# EAGLE design l3 (EAGLE 9.7.0)

## Sheet 1 of 3
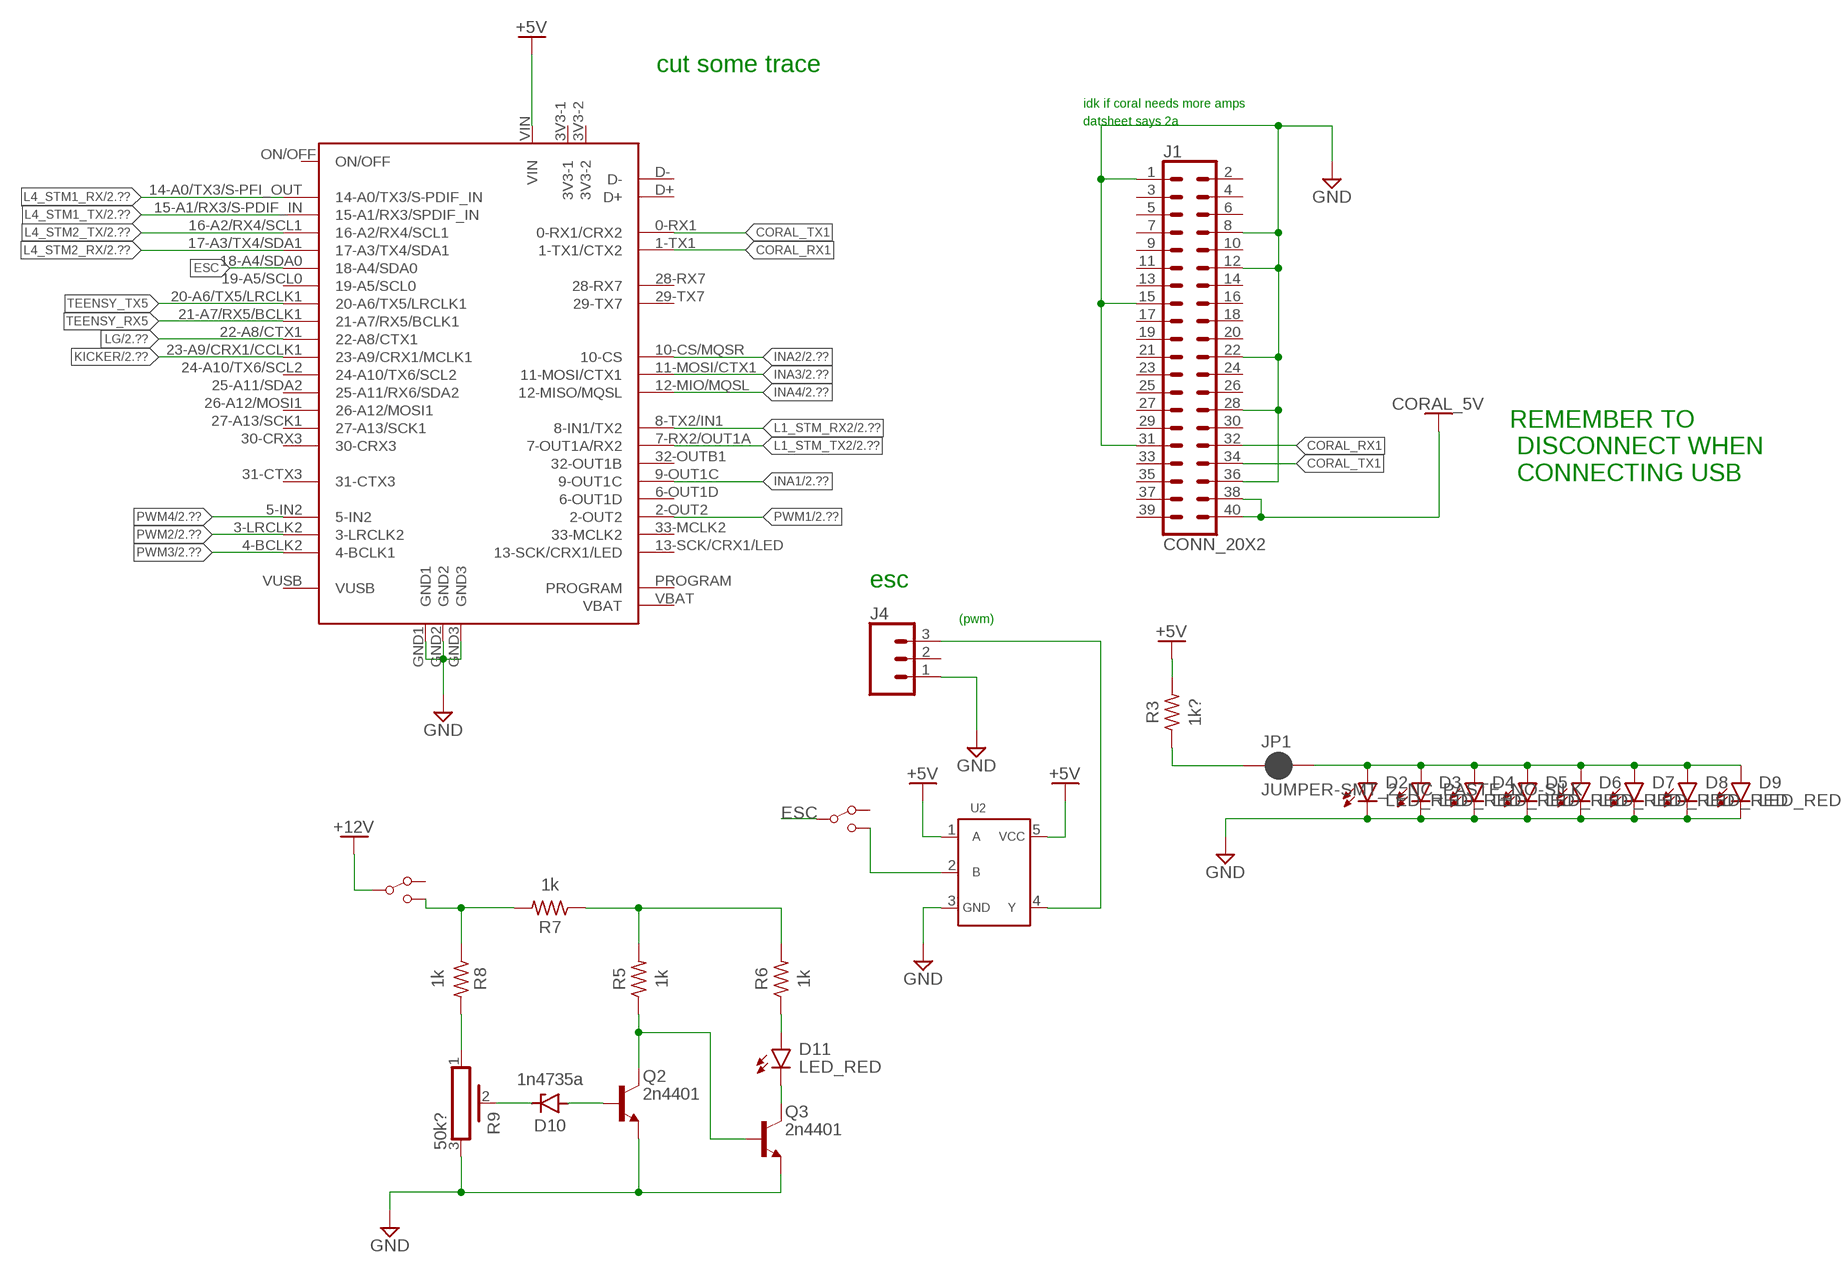
[diagram p0: schematic, sheet 1]

### Parts
D2  LED_RED  CHIP-FLAT-R_0603-0.55MM  [LEDC1608X55N_FLAT-R]
D3  LED_RED  CHIP-FLAT-R_0603-0.55MM  [LEDC1608X55N_FLAT-R]
D4  LED_RED  CHIP-FLAT-R_0603-0.55MM  [LEDC1608X55N_FLAT-R]
D5  LED_RED  CHIP-FLAT-R_0603-0.55MM  [LEDC1608X55N_FLAT-R]
D6  LED_RED  CHIP-FLAT-R_0603-0.55MM  [LEDC1608X55N_FLAT-R]
D7  LED_RED  CHIP-FLAT-R_0603-0.55MM  [LEDC1608X55N_FLAT-R]
D8  LED_RED  CHIP-FLAT-R_0603-0.55MM  [LEDC1608X55N_FLAT-R]
D9  LED_RED  CHIP-FLAT-R_0603-0.55MM  [LEDC1608X55N_FLAT-R]
D10  1n4735a  ZENER  [DO41]
D11  LED_RED  CHIP-FLAT-R_0603-0.55MM  [LEDC1608X55N_FLAT-R]
J1  CONN_20X2  [2X20]
J4  CONN_03LOCK  [1X03_LOCK]
JP1  JUMPER-SMT_2_NC_PASTE_NO-SILK  [SMT-JUMPER_2_NC_PASTE_NO-SILK]
Q2  2n4401  NPN_TO92-EBC  [TO92]
Q3  2n4401  NPN_TO92-EBC  [TO92]
R3  1k?  R-US_CHIP-0603(1608-METRIC)  [RESC1608X60]
R5  1k  R-US_CHIP-0603(1608-METRIC)  [RESC1608X60]
R6  1k  R-US_CHIP-0603(1608-METRIC)  [RESC1608X60]
R7  1k  R-US_CHIP-0603(1608-METRIC)  [RESC1608X60]
R8  1k  R-US_CHIP-0603(1608-METRIC)  [RESC1608X60]
R9  50k?  PV36X  [PV36X]
S1  SPDT-SLIDE-SWITCHSWITCH-TH  [SWITCH-TH]
S2  SPDT-SLIDE-SWITCHSWITCH-TH  [SWITCH-TH]
U2  SN74AHCT1G08  [SOT23-5]
U$1  TEENSY40  [TEENSY40]

### Nets
+5V: R3.2 U2.1 U2.5 U$1.VIN ; also sheet 3
+12V: S1.P$2 ; also sheet 2,3
CORAL_5V: J1.38 J1.40 ; also sheet 3
CORAL_RX1: J1.32 U$1.1-TX1(1-TX1/CTX2)
CORAL_TX1: J1.34 U$1.0-RX1(0-RX1/CRX2)
ESC: S2.P$2 U$1.18-A4/SDA0
GND: D2.C D3.C D4.C D5.C D6.C D7.C D8.C D9.C J1.1 J1.8 J1.12 J1.15 J1.22 J1.28 J1.31 J1.36 J4.1 Q2.1(E) Q3.1(E) R9.3 U2.3 U$1.GND1 U$1.GND2 U$1.GND3 ; also sheet 2,3
INA1: U$1.9-OUT1C ; also sheet 2
INA2: U$1.10-CS/MQSR(10-CS) ; also sheet 2
INA3: U$1.11-MOSI/CTX1 ; also sheet 2
INA4: U$1.12-MIO/MQSL(12-MISO/MQSL) ; also sheet 2
KICKER: U$1.23-A9/CRX1/CCLK1(23-A9/CRX1/MCLK1) ; also sheet 2
L1_STM_RX2: U$1.8-TX2/IN1(8-IN1/TX2) ; also sheet 2
L1_STM_TX2: U$1.7-RX2/OUT1A(7-OUT1A/RX2) ; also sheet 2
L4_STM1_RX: U$1.14-A0/TX3/S-PFI_OUT(14-A0/TX3/S-PDIF_IN) ; also sheet 2
L4_STM1_TX: U$1.15-A1/RX3/S-PDIF_IN(15-A1/RX3/SPDIF_IN) ; also sheet 2
L4_STM2_RX: U$1.17-A3/TX4/SDA1 ; also sheet 2
L4_STM2_TX: U$1.16-A2/RX4/SCL1 ; also sheet 2
LG: U$1.22-A8/CTX1 ; also sheet 2
N$1: D2.A D3.A D4.A D5.A D6.A D7.A D8.A D9.A JP1.2
N$21: JP1.1 R3.1
N$22: D10.C R9.2
N$23: D10.A Q2.2(B)
N$24: Q2.3(C) Q3.2(B) R5.1
N$25: R8.2 R9.1
N$26: R5.2 R6.2 R7.1
N$27: D11.A R6.1
N$28: D11.C Q3.3(C)
N$29: R7.2 R8.1 S1.P$3
N$30: S2.P$3 U2.2
N$32: J4.3 U2.4
PWM1: U$1.2-OUT2 ; also sheet 2
PWM2: U$1.3-LRCLK2 ; also sheet 2
PWM3: U$1.4-BCLK2(4-BCLK1) ; also sheet 2
PWM4: U$1.5-IN2 ; also sheet 2
TEENSY_RX5: U$1.21-A7/RX5/BCLK1
TEENSY_TX5: U$1.20-A6/TX5/LRCLK1
Unconnected: J1.2 J1.3 J1.4 J1.5 J1.6 J1.7 J1.9 J1.10 J1.11 J1.13 J1.14 J1.16 J1.17 J1.18 J1.19 J1.20 J1.21 J1.23 J1.24 J1.25 J1.26 J1.27 J1.29 J1.30 J1.33 J1.35 J1.37 J1.39 J4.2 S1.P$1 S2.P$1 U$1.3V3-1 U$1.3V3-2 U$1.6-OUT1D U$1.13-SCK/CRX1/LED U$1.19-A5/SCL0 U$1.24-A10/TX6/SCL2 U$1.25-A11/SDA2(25-A11/RX6/SDA2) U$1.26-A12/MOSI1 U$1.27-A13/SCK1 U$1.28-RX7 U$1.29-TX7 U$1.30-CRX3 U$1.31-CTX3 U$1.32-OUTB1(32-OUT1B) U$1.33-MCLK2 U$1.D+ U$1.D- U$1.ON/OFF U$1.PROGRAM U$1.VBAT U$1.VUSB

### Notes on the sheet
- cut some trace
- idk if coral needs more amps
- datsheet says 2a
- REMEMBER TO
   DISCONNECT WHEN
   CONNECTING USB
- esc
- (pwm)

## Sheet 2 of 3
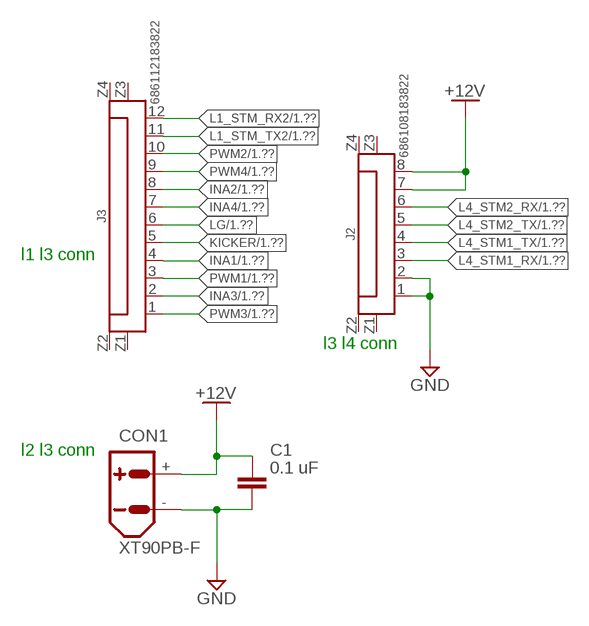
[diagram p1: schematic, sheet 2]

### Parts
C1  0.1 uF  C_CHIP-0603(1608-METRIC)  [CAPC1608X85]
CON1  XT90PB-F  [XT90PB-F]
J2  686108183822  6861XX183822_686108183822  [686108183822]
J3  686112183822  6861XX183822_686112183822  [686112183822]

### Nets
+12V: C1.1 CON1.+ J2.7 J2.8 ; also sheet 1,3
GND: C1.2 CON1.- J2.1 J2.2 ; also sheet 1,3
INA1: J3.4 ; also sheet 1
INA2: J3.8 ; also sheet 1
INA3: J3.2 ; also sheet 1
INA4: J3.7 ; also sheet 1
KICKER: J3.5 ; also sheet 1
L1_STM_RX2: J3.12 ; also sheet 1
L1_STM_TX2: J3.11 ; also sheet 1
L4_STM1_RX: J2.3 ; also sheet 1
L4_STM1_TX: J2.4 ; also sheet 1
L4_STM2_RX: J2.6 ; also sheet 1
L4_STM2_TX: J2.5 ; also sheet 1
LG: J3.6 ; also sheet 1
PWM1: J3.3 ; also sheet 1
PWM2: J3.10 ; also sheet 1
PWM3: J3.1 ; also sheet 1
PWM4: J3.9 ; also sheet 1
Unconnected: J2.Z1 J2.Z2 J2.Z3 J2.Z4 J3.Z1 J3.Z2 J3.Z3 J3.Z4

### Notes on the sheet
- l1 l3 conn
- l3 l4 conn
- l2 l3 conn

## Sheet 3 of 3
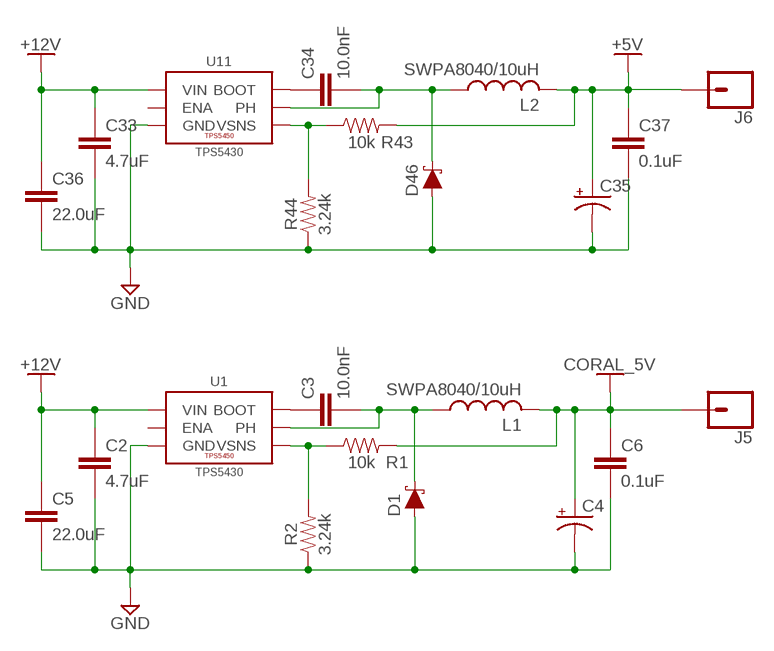
[diagram p2: schematic, sheet 3]

### Parts
C2  4.7uF  CAPACITOR0603  [C0603]
C3  10.0nF  CAPACITOR0603  [C0603]
C4  220uF  CPOL-USD/7343-31R  [D/7343-31R]
C5  22.0uF  CAPACITOR1210  [C1210]
C6  0.1uF  CAPACITOR0603  [C0603]
C33  4.7uF  CAPACITOR0603  [C0603]
C34  10.0nF  CAPACITOR0603  [C0603]
C35  220uF  CPOL-USD/7343-31R  [D/7343-31R]
C36  22.0uF  CAPACITOR1210  [C1210]
C37  0.1uF  CAPACITOR0603  [C0603]
D1  3A/40V/500mV  DIODE-SCHOTTKY-B340A  [SMA-DIODE]
D46  3A/40V/500mV  DIODE-SCHOTTKY-B340A  [SMA-DIODE]
J5  CONN_01  [1X01]
J6  CONN_01  [1X01]
L1  SWPA8040/10uH  INDUCTORSWPA8040  [SWPA8040]
L2  SWPA8040/10uH  INDUCTORSWPA8040  [SWPA8040]
R1  10k  RESISTOR0603  [R0603]
R2  3.24k  RESISTOR0603  [R0603]
R43  10k  RESISTOR0603  [R0603]
R44  3.24k  RESISTOR0603  [R0603]
U1  TPS5430  TPS5450  [POWERPAD-SOIC-8]
U11  TPS5430  TPS5450  [POWERPAD-SOIC-8]

### Nets
+5V: C35.+ C37.1 J6.1 L2.P2 R43.2 ; also sheet 1
+12V: C2.1 C5.1 C33.1 C36.1 U1.7(VIN) U11.7(VIN) ; also sheet 1,2
CORAL_5V: C4.+ C6.1 J5.1 L1.P2 R1.2 ; also sheet 1
GND: C2.2 C4.- C5.2 C6.2 C33.2 C35.- C36.2 C37.2 D1.A D46.A R2.1 R44.1 U1.6(GND) U1.9(GND) U1.P$1(GND) U1.P$2(GND) U1.P$3(GND) U1.P$4(GND) U1.P$5(GND) U1.P$6(GND) U11.6(GND) U11.9(GND) U11.P$1(GND) U11.P$2(GND) U11.P$3(GND) U11.P$4(GND) U11.P$5(GND) U11.P$6(GND) ; also sheet 1,2
N$5: C3.2 D1.C L1.P1 U1.8(PH)
N$6: R1.1 R2.2 U1.4(VSNS)
N$7: C3.1 U1.1(BOOT)
N$45: C34.2 D46.C L2.P1 U11.8(PH)
N$96: R43.1 R44.2 U11.4(VSNS)
N$97: C34.1 U11.1(BOOT)
Unconnected: U1.2(NC) U1.3(NC) U1.5(ENA) U11.2(NC) U11.3(NC) U11.5(ENA)

## Library data of the parts
C1 = Capacitor:C: Capacitor - Generic; CATEGORY: Capacitor
C2 C3 C5 C6 C33 C34 C36 C37 = JH:CAPACITOR
C4 C35 = rcl:CPOL-US: POLARIZED CAPACITOR, American symbol; SPICEPREFIX: C
CON1 = amass xt series:XT90: AMASS XT90 connector Store in Japan AMASS XT90 connector <https://szc.jp/ams-xt90>
D1 D46 = SparkFun-DiscreteSemi:DIODE-SCHOTTKY: Schottky diode A Schottky diode is a semiconductor diode which has a low forward voltage drop and a very fast switching action.; PROD_ID: DIO-09886
D2-D9 D11 = LED:CHIP-FLAT-R; CATEGORY: LED; COLOR: RED; DESCRIPTION: CHIP LED FLAT; SUB-CATEGORY: CHIP; TYPE: FLAT_TOP
D10 = diodess:ZENER: Zener Diode - Generic
J1 = SparkFun-Connectors:CONN_20X2: Multi connection point. Often used as Generic Header-pin footprint for 0.1 inch spaced/style header connections On any of the 0.1 inch spaced packages, you can populate with these: Break Away Headers - Straight <https://www.sparkfun.com/products/116> (PRT-00116) Break Away Male Headers - Right Angle <https://www.sparkfun.com/products/553> (PRT-00553) Female Headers <https://www.sparkfun.com/products/115> (PRT-00115) Break Away Headers - Machine Pin <https://www.sparkfun.com/products/117> (PRT-00117) Break Away Female Headers - Swiss Machine Pin <https://www.sparkfun.com/products/743> (PRT-00743)
J2 = Wurth_Connectors_WR-FPC:6861XX183822_686108183822: WR-FPC 1.00 mm SMT ZIF Vertical Type A KIND PROPERTIES Pitch 1 mm MATERIAL PROPERTIES Insulator Material PA6T Contact Material Phosphor Bronze Contact Plating 120 (µ") Tin over 30 (µ") Nickel Solder Tabs Brass <https://www.we-online.com/catalog/media/o83988v209%20Family_WR-FPC_6861xx183822.jpg> Details see: https://www.we-online.com/catalog/en/FPC_1_00_SMT_ZIF_VERTICAL_TYPE_A_6861XX183822/ Updated by Ella Wu, 2020-08-25 2020 (C) Würth Elektronik; CONTACT-RESISTANCE: 30mOhm; DATASHEET-URL: https://www.we-online.com/catalog/datasheet/686108183822.pdf; IR: 1A; L: 14.8mm; MATE-WITH: WR-FFC 1.00 mm Flat Flexible Cable Type 1 (Contacts on same side)/ Type 2 (Contacts opposite); PACKAGING: Tape and Reel; PART-NUMBER: 686108183822; PINS: 8; PITCH: 1mm; TYPE: Vertical; WORKING-VOLTAGE: 125V(AC)
J3 = Wurth_Connectors_WR-FPC:6861XX183822_686112183822: WR-FPC 1.00 mm SMT ZIF Vertical Type A KIND PROPERTIES Pitch 1 mm MATERIAL PROPERTIES Insulator Material PA6T Contact Material Phosphor Bronze Contact Plating 120 (µ") Tin over 30 (µ") Nickel Solder Tabs Brass <https://www.we-online.com/catalog/media/o83988v209%20Family_WR-FPC_6861xx183822.jpg> Details see: https://www.we-online.com/catalog/en/FPC_1_00_SMT_ZIF_VERTICAL_TYPE_A_6861XX183822/ Updated by Ella Wu, 2020-08-25 2020 (C) Würth Elektronik; CONTACT-RESISTANCE: 30mOhm; DATASHEET-URL: https://www.we-online.com/catalog/datasheet/686112183822.pdf; IR: 1A; L: 18.8mm; MATE-WITH: WR-FFC 1.00 mm Flat Flexible Cable Type 1 (Contacts on same side)/ Type 2 (Contacts opposite); PACKAGING: Tape and Reel; PART-NUMBER: 686112183822; PINS: 12; PITCH: 1mm; TYPE: Vertical; WORKING-VOLTAGE: 125V(AC)
J4 = SparkFun-Connectors:CONN_03: Multi connection point. Often used as Generic Header-pin footprint for 0.1 inch spaced/style header connections On any of the 0.1 inch spaced packages, you can populate with these: Break Away Headers - Straight <https://www.sparkfun.com/products/116> (PRT-00116) Break Away Male Headers - Right Angle <https://www.sparkfun.com/products/553> (PRT-00553) Female Headers <https://www.sparkfun.com/products/115> (PRT-00115) Break Away Headers - Machine Pin <https://www.sparkfun.com/products/117> (PRT-00117) Break Away Female Headers - Swiss Machine Pin <https://www.sparkfun.com/products/743> (PRT-00743) Stackable Header - 3 Pin (Female, 0.1") <https://www.sparkfun.com/products/13875> (PRT-13875) For SCREWTERMINALS and SPRING TERMINALS visit here: Screw Terimnals on SparkFun.com <https://www.sparkfun.com/search/results?term=Screw+Terminals> (5mm/3.5mm/2.54mm spacing) This device is also useful as a general connection point to wire up your design to another part of your project. Our various solder wires solder well into these plated through hole pads. Hook-Up Wire - Assortment (Stranded, 22 AWG) <https://www.sparkfun.com/products/11375> (PRT-11375) Hook-Up Wire - Assortment (Solid Core, 22 AWG) <https://www.sparkfun.com/products/11367> (PRT-11367) View the entire wire category on our website here <https://www.sparkfun.com/categories/141> Special notes: Molex polarized connector foot print use with SKU : PRT-08232 with associated crimp pins and housings.
J5 J6 = SparkFun-Connectors:CONN_01: Single connection point. Often used as Generic Header-pin footprint for 0.1 inch spaced/style header connections On any of the 0.1 inch spaced packages, you can populate with these: Break Away Headers - Straight <https://www.sparkfun.com/products/116> (PRT-00116) Break Away Male Headers - Right Angle <https://www.sparkfun.com/products/553> (PRT-00553) Female Headers <https://www.sparkfun.com/products/115> (PRT-00115) Break Away Headers - Machine Pin <https://www.sparkfun.com/products/117> (PRT-00117) Break Away Female Headers - Swiss Machine Pin <https://www.sparkfun.com/products/743> (PRT-00743) This device is also useful as a general connection point to wire up your design to another part of your project. Our various solder wires solder well into these plated through hole pads. Hook-Up Wire - Assortment (Stranded, 22 AWG) <https://www.sparkfun.com/products/11375> (PRT-11375) Hook-Up Wire - Assortment (Solid Core, 22 AWG) <https://www.sparkfun.com/products/11367> (PRT-11367) View the entire wire category on our website here <https://www.sparkfun.com/categories/141> Special notes: SMTSO-256-ET is a "flush mount" nut for a 4-40 screw. We mostly use this on specialty testbeds; it is a nice way to connect hardware to your PCB at an adjustable hieght. Also note, the SNAP packages are for using a snappable style connector. We sell a baggie of snaps and they are also used on two LilyPad designs: Snap Assortment - 30 pack (male and female) <https://www.sparkfun.com/products/11347> (DEV-11347) LilyPad Arduino SimpleSnap <https://www.sparkfun.com/products/10941> (DEV-10941) LilyPad SimpleSnap Protoboard <https://www.sparkfun.com/products/10940> (DEV-10940)
JP1 = SparkFun-Jumpers:JUMPER-SMT_2_NC_PASTE: Normally closed solder jumper This jumper has an aperture in the stencil to allow solder paste to bridge the split in the wire so it's normally closed (NC). Wick off the solder to open the connection. Reapply solder to reclose the connection.
L1 L2 = JH:INDUCTOR
Q2 Q3 = Transistor:NPN: NPN - Generic; CATEGORY: Transistor; SUB-CATEGORY: BJT; TYPE: NPN; VALUE: NPN
R1 R2 R43 R44 = JH:RESISTOR
R3 R5-R8 = Resistor:R-US: Resistor Fixed - ANSI; CATEGORY: Resistor; SUB-CATEGORY: Fixed
R9 = Resistor:PV36: Rectangular Trimmer Potentiometers - PV36 Series Datasheet <https://www.bourns.com/docs/Product-Datasheets/pv36.pdf>; CATEGORY: Resistor; DESCRIPTION: Lead Sealed Type Multiturn PV36 Series; MANUFACTURER: BOURNS; MPN: PV36X; OPERATING_TEMPERATURE: -55 to +125 °C; PART_STATUS: Active; ROHS_COMPLIANCE: RoHS Compliant; SERIES: PV36; SUB-CATEGORY: Trimpot; TYPE: Lead sealed
S1 S2 = i want to make my own parts:SPDT-SLIDE-SWITCH
U1 U11 = JH:TPS5450
U2 = i want to make my own parts:SN74AHCT1G08
U$1 = teensy:TEENSY40: Teensy 4.0 device including POGO pins for pins 24 - 33, but not yet pins for D+ and D-. Symbol layout is what works for me and may not suite everyone... that can be added or additional symbols can be created to be used in a modilied davie name.

## Board
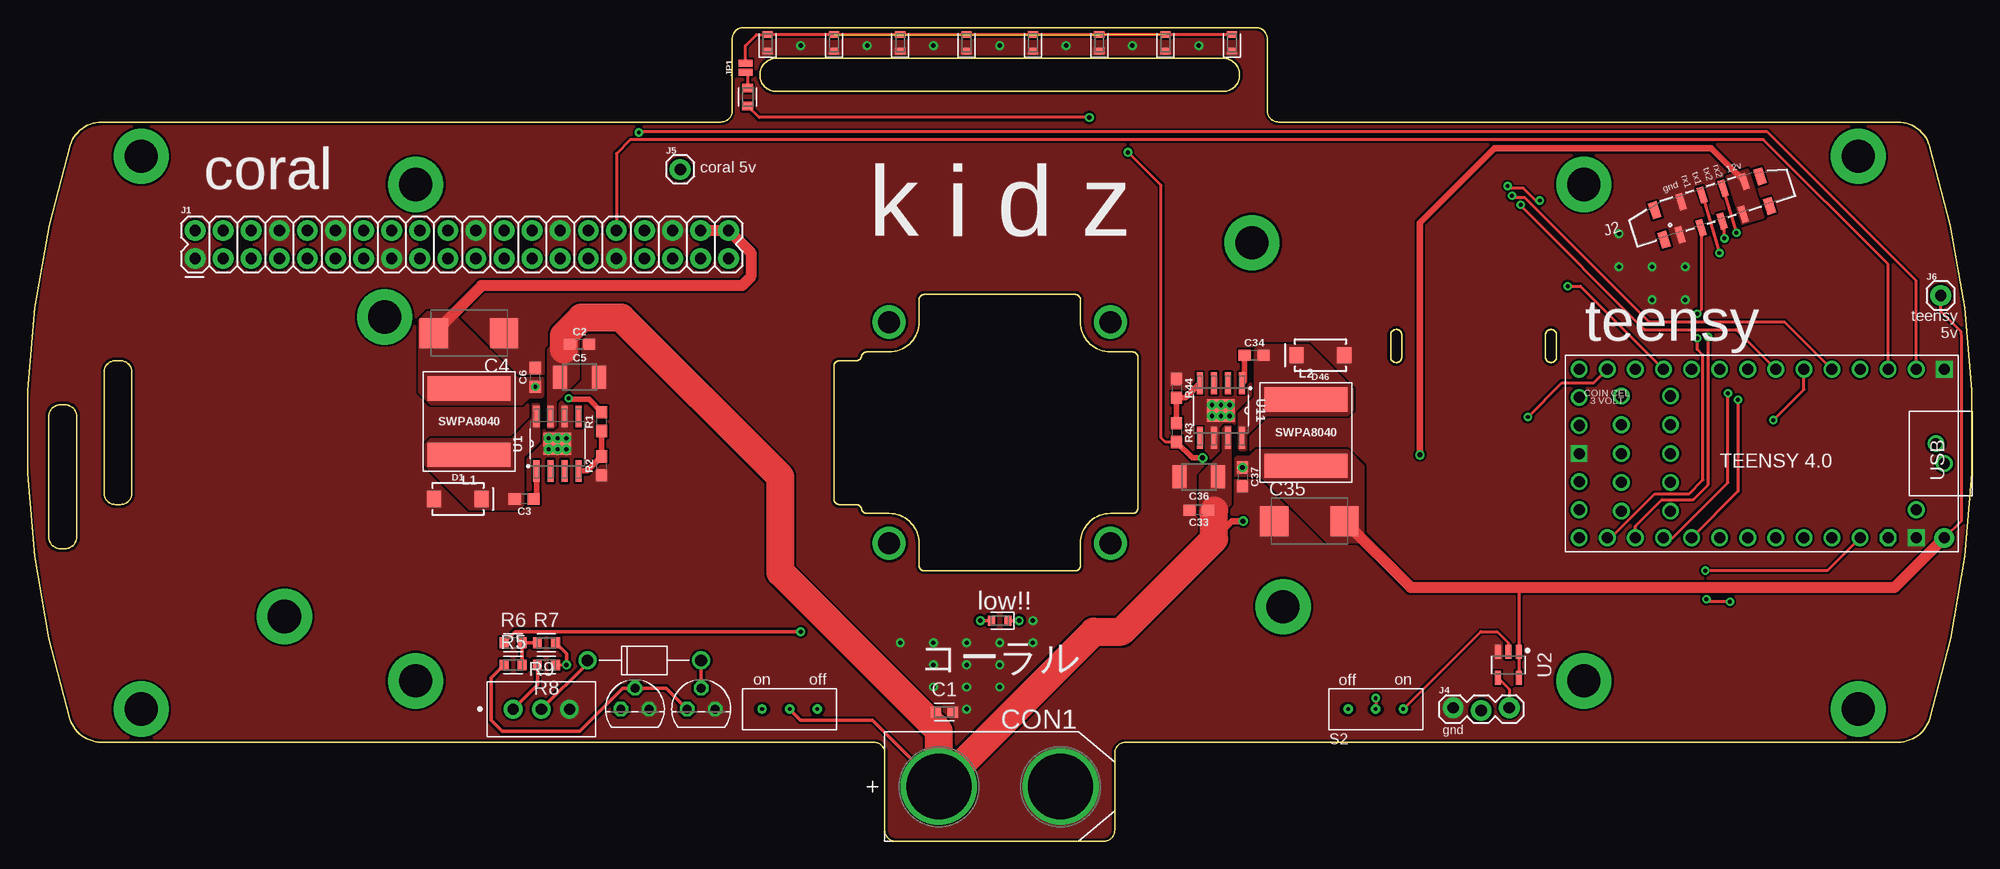
[diagram p3: board, top side]
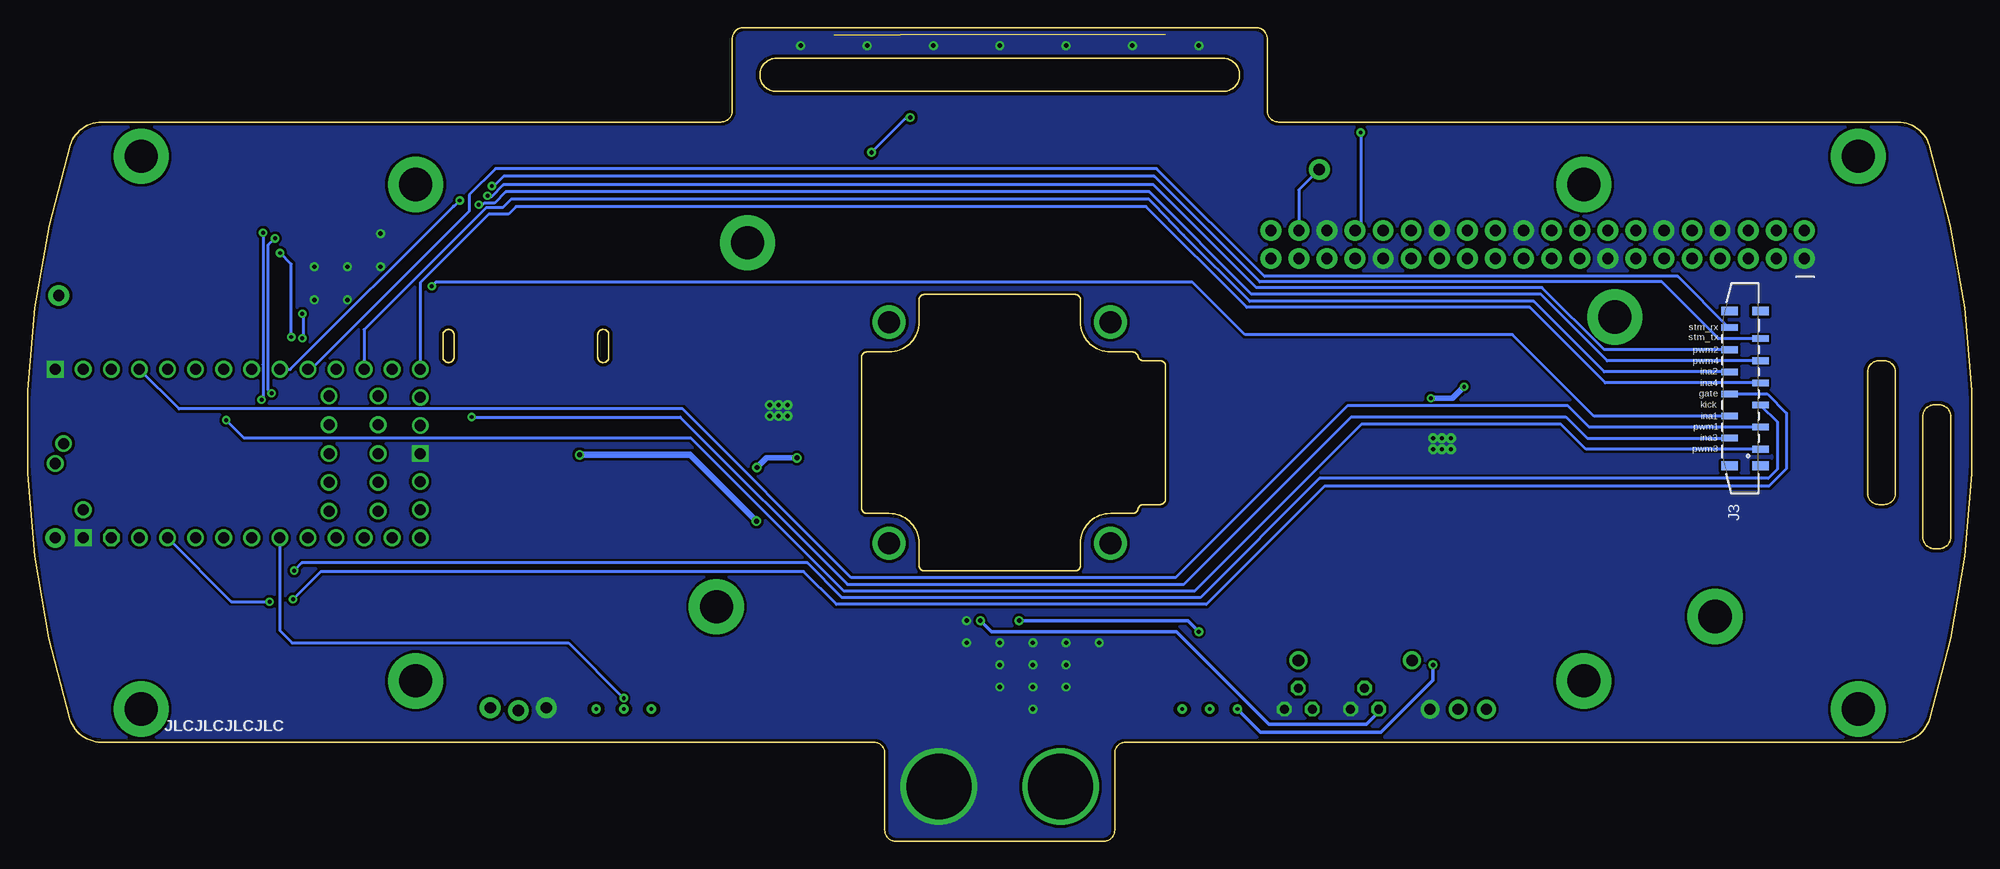
[diagram p4: board, bottom side, seen from below]

Size 175.84 x 73.57 mm. Coordinates in mm from the lower left corner, seen from the top.
Outline: 67.72,70.8 arc180 67.72,67.8 108.12,67.8 arc180 108.12,70.8 67.72,70.8
Outline: 7.92,43.45 arc90 6.92,42.45 6.92,31.45 arc90 7.92,30.45 8.42,30.45 arc90 9.42,31.45 9.42,42.45 arc90 8.42,43.45 7.92,43.45
Outline: 137.28,43.78 arc180 138.28,43.78 138.28,45.78 arc180 137.28,45.78 137.28,43.78
Outline: 75.41,30.05 arc78 74.92,30.45 73.42,30.45 arc-90 72.92,30.95 72.92,42.95 arc-90 73.42,43.45 74.92,43.45 arc78 75.41,43.85 arc-78 75.9,44.25 77.92,44.25 arc90 80.62,46.95 80.62,48.95 arc-90 81.12,49.45 94.72,49.45 arc-90 95.22,48.95 95.22,46.95 arc90 97.92,44.25 99.92,44.25 arc-90 100.42,43.75 100.42,30.15 arc-90 99.92,29.65 97.92,29.65 arc90 95.22,26.95 95.22,24.95 arc-90 94.72,24.45 81.12,24.45 arc-90 80.62,24.95 80.62,26.95 arc90 77.92,29.65 75.9,29.65 arc-78 75.41,30.05
Outline: 124.28,45.78 arc180 123.28,45.78 123.28,43.78 arc180 124.28,43.78 124.28,45.78
Outline: 2.92,39.46 arc90 1.92,38.46 1.92,27.46 arc90 2.92,26.46 3.42,26.46 arc90 4.42,27.46 4.42,38.46 arc90 3.42,39.46 2.92,39.46
Outline: 112.12,66.03 112.12,72.57 arc90 111.12,73.57 64.72,73.57 arc90 63.72,72.57 63.72,66.03 arc-90 62.72,65.03 6.71,65.03 arc73 3.84,62.92 arc34 3.81,11.08 arc73 6.68,8.96 76.52,8.96 arc-90 77.52,7.96 77.52,1 arc90 78.52,0 97.32,0 arc90 98.32,1 98.32,7.96 arc-90 99.32,8.96 169.17,8.96 arc73 172.03,11.08 arc34 172,62.92 arc73 169.14,65.03 113.12,65.03 arc-90 112.12,66.03
Copper layers (1*16): Top / Bottom
Stack-up Default Layer Stack: Top User Defined 0.035mm / Dielectric-1 User Defined 1.5mm / Bottom User Defined 0.035mm
Design rules: minimum copper width 6mil, minimum drill size 0.35mm, copper clearance wire_polygon to wire_polygon 6mil, copper clearance wire_polygon to pad_smd 6mil, copper clearance wire_polygon to via 6mil, copper clearance pad_smd to pad_smd 6mil, copper clearance pad_smd to via 6mil, copper clearance via to via 6mil, copper clearance smd to pad (same net) 6mil, copper clearance smd to via (same net) 6mil, copper clearance smd to smd (same net) 6mil, dimension clearance 6mil, restrict clearance 0mil, drill distance 6mil, keepout clearance 0mil

### Footprints (pad centres in the part's own frame; a part is rotated, then mirrored left to right if it is on the bottom)
CAPC1608X85 = smd 0.921 x 0.97: 1 -0.775,0; 2 0.775,0
C0603 = smd 1.1 x 1: 1 -0.85,0; 2 0.85,0
D/7343-31R = smd 2.55 x 2.7: + 3.175,0; - -3.175,0
C1210 = smd 1.27 x 2.06: 1 -1.755,0; 2 1.755,0
XT90PB-F = drill 5.9: + 5.5,0; - -5.5,0
SMA-DIODE = smd 1.27 x 1.47: A -2.15,0; C 2.15,0
LEDC1608X55N_FLAT-R = smd 0.612 x 0.912: A 0.75,0; C -0.75,0
DO41 = drill 1.06 pad 1.63: A 5.14,0; C -5.14,0
2X20 = drill 1.016 pad 1.88: 1 0,0; 2 0,2.54; 3 2.54,0; 4 2.54,2.54; 5 5.08,0; 6 5.08,2.54; 7 7.62,0; 8 7.62,2.54; 9 10.16,0; 10 10.16,2.54; 11 12.7,0; 12 12.7,2.54; 13 15.24,0; 14 15.24,2.54; 15 17.78,0; 16 17.78,2.54; 17 20.32,0; 18 20.32,2.54; 19 22.86,0; 20 22.86,2.54; 21 25.4,0; 22 25.4,2.54; 23 27.94,0; 24 27.94,2.54; 25 30.48,0; 26 30.48,2.54; 27 33.02,0; 28 33.02,2.54; 29 35.56,0; 30 35.56,2.54; 31 38.1,0; 32 38.1,2.54; 33 40.64,0; 34 40.64,2.54; 35 43.18,0; 36 43.18,2.54; 37 45.72,0; 38 45.72,2.54; 39 48.26,0; 40 48.26,2.54
686108183822 = smd 0.6 x 1.5: 1 -3.5,-1.8; 2 -2.5,1; 3 -1.5,-1.8; 4 -0.5,1; 5 0.5,-1.8; 6 1.5,1; 7 2.5,-1.8; 8 3.5,1 | smd 0.8 x 1.5: Z1 -5,-1.8; Z2 -5,1; Z3 5,-1.8; Z4 5,1
686112183822 = smd 0.6 x 1.5: 1 -5.5,-1.8; 2 -4.5,1; 3 -3.5,-1.8; 4 -2.5,1; 5 -1.5,-1.8; 6 -0.5,1; 7 0.5,-1.8; 8 1.5,1; 9 2.5,-1.8; 10 3.5,1; 11 4.5,-1.8; 12 5.5,1 | smd 0.8 x 1.5: Z1 -7,-1.8; Z2 -7,1; Z3 7,-1.8; Z4 7,1
1X03_LOCK = drill 1.016 pad 1.88: 1 0,0.127; 2 2.54,-0.127; 3 5.08,0.127
1X01 = drill 1.016 pad 1.88: 1 0,0
SMT-JUMPER_2_NC_PASTE_NO-SILK = smd 0.635 x 1.27: 1 -0.406,0; 2 0.406,0
SWPA8040 = smd 2.2 x 7.5: P1 -3,0; P2 3,0
TO92 = drill 0.813 octagon: 1 1.27,0; 2 0,1.905; 3 -1.27,0
R0603 = smd 1.1 x 1: 1 -0.85,0; 2 0.85,0
RESC1608X60 = smd 0.799 x 0.974: 1 -0.815,0; 2 0.815,0
PV36X = drill 1 pad 1.7: 1 0,0; 2 2.54,0; 3 5.08,0
SWITCH-TH = drill 0.33 slot 0.53: P$1 -2.5,0; P$2 0,0; P$3 2.5,0
POWERPAD-SOIC-8 = smd 1.981 x 0.559: 1 -2.464,1.905; 2 -2.464,0.635; 3 -2.464,-0.635; 4 -2.464,-1.905; 5 2.464,-1.905; 6 2.464,-0.635; 7 2.464,0.635; 8 2.464,1.905 | smd 2.007 x 2.489: 9 0,0 | drill 0.381: P$1 -0.5,0.8; P$2 0.5,0.8; P$3 -0.5,0; P$4 0.5,0; P$5 -0.5,-0.8; P$6 0.5,-0.8
SOT23-5 = smd 1.267 x 0.577: 1 -1.175,0.95; 2 -1.175,0; 3 -1.175,-0.95; 4 1.175,-0.95; 5 1.175,0.95
TEENSY40 = drill 1: 0-RX1 -13.97,-7.62; 1-TX1 -11.43,-7.62; 2-OUT2 -8.89,-7.62; 3-LRCLK2 -6.35,-7.62; 3V3-2 16.51,-2.54; 4-BCLK2 -3.81,-7.62; 5-IN2 -1.27,-7.62; 6-OUT1D 1.27,-7.62; 7-RX2/OUT1A 3.81,-7.62; 8-TX2/IN1 6.35,-7.62; 9-OUT1C 8.89,-7.62; 10-CS/MQSR 11.43,-7.62; 11-MOSI/CTX1 13.97,-7.62; 12-MIO/MQSL 16.51,-7.62; 13-SCK/CRX1/LED 16.51,7.62; 14-A0/TX3/S-PFI_OUT 13.97,7.62; 15-A1/RX3/S-PDIF_IN 11.43,7.62; 16-A2/RX4/SCL1 8.89,7.62; 17-A3/TX4/SDA1 6.35,7.62; 18-A4/SDA0 3.81,7.62; 19-A5/SCL0 1.27,7.62; 20-A6/TX5/LRCLK1 -1.27,7.62; 21-A7/RX5/BCLK1 -3.81,7.62; 22-A8/CTX1 -6.35,7.62; 23-A9/CRX1/CCLK1 -8.89,7.62; 24-A10/TX6/SCL2 12.7,5.207; 25-A11/SDA2 8.255,5.207; 26-A12/MOSI1 12.7,2.603; 27-A13/SCK1 8.255,2.603; 28-RX7 12.7,0; 29-TX7 8.255,0; 30-CRX3 12.7,-2.603; 31-CTX3 8.255,-2.603; 32-OUTB1 12.7,-5.207; 33-MCLK2 8.255,-5.207; D+ -15.75,-0.9; D- -16.51,0.9; ON/OFF 16.51,5.08; PROGRAM 16.51,2.54; VBAT 16.51,-5.08; VUSB -13.97,5.08 | drill 1 octagon: 3V3-1 -11.43,7.62 | drill 1 square: GND1 -16.51,-7.62; GND2 16.51,0; GND3 -13.97,7.62 | drill 1 pad 1.778: VIN -16.51,7.62

### Placement (x,y rotation side)
C1  82.9,11.67 0 top
C2  49.92,44.95 0 top
C3  44.92,30.95 180 top
C4  39.92,45.95 180 top
C5  49.92,41.95 0 top
C6  45.92,41.95 90 top
C33  105.92,29.95 180 top
C34  110.92,43.95 0 top
C35  115.92,28.95 0 top
C36  105.92,32.95 180 top
C37  109.88,32.95 270 top
CON1  87.92,4.95 180 top
D1  38.92,30.95 0 top
D2  66.92,72.2 90 top
D3  72.92,72.2 90 top
D4  78.92,72.2 90 top
D5  84.92,72.2 90 top
D6  90.92,72.2 90 top
D7  96.92,72.2 90 top
D8  102.92,72.2 90 top
D9  108.92,72.2 90 top
D10  55.77,16.35 0 top
D11  87.92,19.95 180 top
D46  116.92,43.95 180 top
J1  15.15,52.69 0 top
J2  152.23,57.64 17.8 top
J3  20.92,40.95 90 bottom
J4  128.92,11.95 0 top
J5  59.02,60.75 0 top
J6  173.02,49.35 0 top
JP1  64.92,69.95 90 top
L1  39.92,37.95 90 top
L2  115.62,36.95 270 top
Q2  60.92,11.95 0 top
Q3  54.92,11.95 0 top
R1  51.92,37.95 90 top
R2  51.92,33.95 90 top
R3  65.12,67.3 270 top
R5  43.92,15.95 0 top
R6  43.92,17.95 0 top
R7  46.92,17.95 0 top
R8  46.92,15.95 180 top
R9  43.92,11.95 0 top
R43  103.92,36.95 270 top
R44  103.92,40.95 270 top
S1  68.92,11.95 180 top
S2  121.92,11.95 0 top
U1  47.92,35.95 90 top
U2  133.92,15.95 270 top
U11  107.92,38.95 270 top
U$1  156.85,35.06 180 top

### Tracks (layer width: path | path; a pad name or v marks a point on that pad's centre or on a via)
+5V  (via drill 0.4, 0.45)
  Top 0.254: 173.02,47.92 173.02,47.95 | 173.02,47.95 J6.1 | R43.2 102.92,36.1 102.52,36.5 102.52,59.3 v99.52,62.3 | v96.02,65.45 66.16,65.45 R3.2 | U$1.VIN 174.92,29 174.92,45.54 174.88,46.09 173.02,47.95 | U2.5 U2.1 134.92,17.17 134.92,22.95
  Top 0.508: R43.2 105.36,34.66 v106.26,34.66
  Top 1.016: C35.+ 125.1,22.95 134.92,22.95 168.87,22.95 U$1.VIN
  Bottom 0.254: v99.52,62.3 96.37,65.45 v96.02,65.45
  Bottom 0.508: v106.26,34.66 109.02,34.66 C37.1
  other vias: 109.88,33.8
  pour Top (no thermals): 120.92,26.95 120.92,33.95 119.41,35.46 111.1,35.46 110.5,34.86 109.34,34.86 109.14,34.66 109.14,32.99 109.19,32.94 111.52,32.94 117.51,26.95
+12V  (via drill 0.45)
  Top 0.305: S1.P$2 69.92,10.95 76.42,10.95 CON1.+
  Top 0.508: C1.1 82.42,11.38 82.42,9.97
  Top 0.61: J2.7 155.16,56.79 | 107.3,27.33 108.92,28.95 v109.92,28.95 | v125.92,34.95 125.92,55.92 132.66,62.65 150.92,62.65 151.39,62.65 152.27,62.65 J2.8
  Top 2.54: 107.3,29.92 107.3,27.33 98.92,18.95 96.42,18.95 CON1.+ 82.42,9.97 68.08,24.31 68.08,32.94 53.68,47.34 50.1,47.34 48.48,45.72 48.48,44.45
  Bottom 0.61: v109.92,28.95 115.92,34.95 v125.92,34.95
  pour Top (no thermals): 108.88,30.44 108.88,37.57 108.84,37.61 108.27,37.61 108,37.34 108,35.18 105.92,33.1 105.92,29.5 106.34,29.08 107.52,29.08
  pour Top (no thermals): 46.96,44.46 46.96,37.33 47,37.29 47.57,37.29 47.84,37.56 47.84,39.72 49.92,41.8 49.92,45.4 49.5,45.82 48.32,45.82
  pour Top (no thermals): 155.02,55.7 153.57,60.2 155.62,60.85 157.12,56.35
CORAL_5V  (via drill 0.35)
  Top 0.508: R1.2 50.77,39.95 49.03,39.95 v48.92,40.06
  Top 1.016: J1.38 J1.40 65.42,53.22 65.42,51.05 64.62,50.25 41.05,50.25 C4.+
  Bottom 0.254: J5.1 60.87,58.9 J1.38
  Bottom 0.508: C6.1 46.96,40.06 v48.92,40.06
  other vias: 45.92,41.1
  pour Top (no thermals): 36.12,47.95 35.32,47.15 35.32,40.55 36.43,39.44 44.74,39.44 45.34,40.04 46.5,40.04 46.7,40.24 46.7,41.91 46.65,41.96 44.32,41.96 38.33,47.95
CORAL_RX1
  Top 0.254: U$1.1-TX1 168.28,52.15 157,63.43 54.51,63.43 53.25,62.17 J1.32
CORAL_TX1  (via drill 0.35)
  Top 0.254: U$1.0-RX1 170.82,50.69 157.36,64.14 55.68,64.14 55.63,64.09 v55.28,64.09
  Bottom 0.254: v55.28,64.09 55.28,55.74 J1.34
ESC  (via drill 0.35)
  Top 0.254: v121.92,12.95 S2.P$2
  Bottom 0.254: U$1.18-A4/SDA0 153.04,19.06 151.92,17.95 126.92,17.95 v121.92,12.95
GND  (via drill 0.4)
  other vias: 90.92,19.95 78.92,17.95 81.92,17.95 81.92,15.95 84.92,15.95 84.92,17.95 87.92,17.95 87.92,15.95 90.92,17.95 84.92,13.95 87.92,13.95 81.92,13.95 84.92,11.95 149.92,51.95 146.92,51.95 146.92,48.95 149.92,48.95 143.92,51.95 143.92,54.95 69.92,71.95 75.92,71.95 81.92,71.95 87.92,71.95 93.92,71.95 99.92,71.95 105.92,71.95
  pour Bottom (isolate 0.254, rank 6, no thermals): 7.92,75.95 166.92,75.95 183.92,58.95 183.92,5.95 172.92,-5.05 5.92,-5.05 -14.08,14.95 -14.08,53.95
  pour Top (isolate 0.203, rank 6, no thermals): 3.92,74.95 178.92,74.95 189.92,63.95 189.92,4.95 177.92,-7.05 -2.08,-7.05 -18.08,8.95 -18.08,52.95
INA1  (via drill 0.35)
  Top 0.254: v139.29,50.19 140.45,50.19 U$1.9-OUT1C
  Bottom 0.254: J3.4 34.18,38.45 41.54,45.81 65.74,45.81 70.48,50.55 138.93,50.55 v139.29,50.19
INA2
  Bottom 0.254: J3.8 33.24,42.45 39.62,48.83 65.31,48.83 71.3,54.82 73.92,57.55 74.42,58.05 132.12,58.05 132.87,57.3 134.37,57.3 145.42,46.25 U$1.10-CS/MQSR
INA3  (via drill 0.35)
  Top 0.254: v135.69,38.36 138.77,41.44 141.64,41.44 U$1.11-MOSI/CTX1
  Bottom 0.254: J3.2 34.79,36.45 36.72,38.38 56.13,38.38 71.27,23.24 101.7,23.24 116.82,38.36 v135.69,38.36
INA4
  Bottom 0.254: J3.7 33.16,41.45 39.99,48.28 65.57,48.28 74.69,57.39 131.69,57.39 132.36,56.72 134.13,56.72 140.34,50.51 U$1.12-MIO/MQSL
KICKER  (via drill 0.35)
  Top 0.254: v151.74,24.47 162.77,24.47 U$1.23-A9/CRX1/CCLK1
  Bottom 0.254: J3.5 17.59,37.92 17.59,33.66 18.43,32.82 59,32.82 69.78,22.04 102.19,22.04 105.32,25.17 151.04,25.17 v151.74,24.47
L1_STM_RX2
  Bottom 0.254: J3.12 21.97,46.45 26.6,51.08 63.98,51.08 73.73,60.82 133.53,60.82 135.91,58.45 135.91,56.98 150.22,42.68 U$1.8-TX2/IN1
L1_STM_TX2  (via drill 0.35)
  Top 0.254: v136.77,57.94 136.4,57.94 135.29,59.05 134.06,59.05 v133.86,59.25
  Bottom 0.254: J3.11 22.89,45.45 28.03,50.59 64.4,50.59 73.93,60.12 132.8,60.12 133.67,59.25 v133.86,59.25 | U$1.7-RX2/OUT1A 152.08,42.68 137.32,57.44 137.27,57.44 v136.77,57.94
L4_STM1_RX  (via drill 0.35)
  Top 0.254: J2.3 151.35,48.05 v151,47.7 | U$1.14-A0/TX3/S-PFI_OUT 142.9,27.46 143.21,27.46 147.18,31.42 150.27,31.42 151.53,32.67 151.53,43.95 151,44.48 v151,45.49
  Bottom 0.254: v151,47.7 150.9,47.6 150.9,45.65 151,45.55 v151,45.49
L4_STM1_TX  (via drill 0.35)
  Top 0.254: J2.4 v153.01,53.2 | U$1.15-A1/RX3/S-PDIF_IN 145.42,28.48 147.82,30.88 150.64,30.88 151.99,32.24 v151.99,45.6
  Bottom 0.254: v151.99,45.6 151.99,52.18 v153.01,53.2
L4_STM2_RX  (via drill 0.35)
  Top 0.254: J2.6 154.59,55.04 154.58,55.03 v154.55,55.03 | v154.69,39.93 154.69,31.63 U$1.17-A3/TX4/SDA1
  Bottom 0.254: v154.55,55.03 154.55,43.12 154.54,43.1 154.54,40.08 v154.69,39.93
L4_STM2_TX  (via drill 0.35)
  Top 0.254: U$1.16-A2/RX4/SCL1 148.79,27.44 153.78,32.43 v153.78,40.51 | v153.47,54.52 153.42,54.57 153.42,55.92 J2.5
  Bottom 0.254: v153.78,40.51 154.07,40.79 154.07,53.92 v153.47,54.52
LG  (via drill 0.35)
  Top 0.254: v153.96,21.66 152.06,21.66 v151.84,21.88
  Bottom 0.254: U$1.22-A8/CTX1 157.42,21.66 v153.96,21.66 | J3.6 18.5,40.45 16.76,38.71 16.76,33.7 18.35,32.11 58.54,32.11 69.23,21.42 102.69,21.42 105.66,24.39 149.33,24.39 v151.84,21.88
N$1  (5 unrouted)
  Top 0.254: JP1.2 64.92,71.95 65.92,72.95 D2.A D8.A D9.A
N$2  (via drill 3 pad 5)
  other vias: 140.74,14.5
N$3  (via drill 3 pad 5)
  other vias: 165.57,11.96
N$4  (via drill 3 pad 5)
  other vias: 113.55,21.21
N$5
  pour Top (no thermals): 35.92,35.95 35.92,33.95 39.92,29.95 44.46,29.95 44.91,30.4 44.91,34.7 46.37,36.16 46.37,39.46 46.22,39.61 45.67,39.61 45.56,39.5 45.56,38.24 43.78,36.46 36.43,36.46
N$6
  Top 0.508: R1.1 R2.2 50.61,33.48 U1.4
N$7
  Top 0.508: U1.1 46.02,31.19 C3.1
N$8  (via drill 3 pad 5)
  other vias: 110.73,54.11
N$9  (via drill 3 pad 5)
  other vias: 140.74,59.39
N$10  (via drill 3 pad 5)
  other vias: 165.57,61.93
N$11  (via drill 3 pad 5)
  other vias: 10.28,11.96
N$12  (via drill 3 pad 5)
  other vias: 23.23,20.33
N$13  (via drill 3 pad 5)
  other vias: 35.1,14.5
N$14  (via drill 3 pad 5)
  other vias: 10.28,61.93
N$15  (via drill 3 pad 5)
  other vias: 35.1,59.39
N$16  (via drill 3 pad 5)
  other vias: 32.29,47.41
N$17  (via drill 2 pad 3)
  other vias: 97.92,46.95
N$18  (via drill 2 pad 3)
  other vias: 97.92,26.95
N$19  (via drill 2 pad 3)
  other vias: 77.92,46.95
N$20  (via drill 2 pad 3)
  other vias: 77.92,26.95
N$21
  Top 0.254: JP1.1 65.12,69.34 R3.1
N$22
  Top 0.305: R9.2 50.63,16.12 D10.C
N$23
  Top 0.305: D10.A Q2.2
N$24
  Top 0.305: Q2.3 57.75,13.85 Q3.2 53.83,13.85 49.92,9.95 42.92,9.95 41.92,10.95 41.92,14.76 R5.1
N$25
  Top 0.305: R9.1 46.11,14.13 R8.2
N$26
  Top 0.305: R5.2 R6.2 R7.1
N$27  (via drill 0.4)
  Top 0.305: R6.1 44.11,18.95 v69.92,18.95 | v86.17,19.95 D11.A
  Bottom 0.305: v69.92,18.95 70.92,19.95 v86.17,19.95
N$28  (via drill 0.4)
  Top 0.305: v89.67,19.95 D11.C
  Bottom 0.305: v89.67,19.95 88.67,18.95 71.92,18.95 63.57,10.6 54.77,10.6 53.65,11.72 Q3.3
N$29  (via drill 0.4)
  Top 0.254: R8.1 v48.74,15.95
  Top 0.305: R7.2 48.74,16.95 v48.74,15.95
  Bottom 0.305: v48.74,15.95 48.74,14.55 53.44,9.85 64.32,9.85 S1.P$3
N$30
  Top 0.254: S2.P$3 131.42,18.95 132.92,18.95 133.92,17.95 U2.2
N$32
  Top 0.254: U2.4 134,13.74 J4.3
N$45
  pour Top (no thermals): 119.92,38.95 119.92,40.95 115.92,44.95 111.38,44.95 110.93,44.5 110.93,40.2 109.47,38.74 109.47,35.44 109.62,35.29 110.17,35.29 110.28,35.4 110.28,36.66 112.06,38.44 119.41,38.44
N$96
  Top 0.508: U11.4 104.7,40.1 R44.2 R43.1
N$97
  Top 0.508: C34.1 110.07,41.66 U11.1
PWM1
  Bottom 0.254: U$1.2-OUT2 162.15,39.09 116.59,39.09 101.35,23.85 72.02,23.85 56.47,39.4 36.56,39.4 34.61,37.45 J3.3
PWM2  (via drill 0.35)
  Top 0.254: U$1.3-LRCLK2 158.9,46.97 146.62,46.97 135.38,58.21 134.4,58.21 v134.25,58.36
  Bottom 0.254: v134.25,58.36 134.14,58.25 133.93,58.25 132.82,59.36 74.01,59.36 64.71,50.06 38.87,50.06 33.26,44.45 J3.10
PWM3  (via drill 0.35)
  Top 0.254: v157.89,38.08 160.66,40.84 U$1.4-BCLK2
  Bottom 0.254: J3.1 34.91,35.45 37.16,37.7 55.23,37.7 70.3,22.63 102.02,22.63 115.85,36.46 156.27,36.46 v157.89,38.08
PWM4  (via drill 0.35)
  Top 0.254: v135.04,57.56 135.04,57.44 146.23,46.26 154.54,46.26 U$1.5-IN2
  Bottom 0.254: J3.9 32.97,43.45 39,49.48 65.16,49.48 74.4,58.72 132.61,58.72 133.62,57.71 134.54,57.71 134.69,57.56 v135.04,57.56

### Text on the board
tPlace: coral 5v | rx2 | 12v | rx1 | tx1 | tx2 | coral | gnd | k i d z | teensy / 5v | teensy | low!! | コーラル | on | off | off | on | gnd
bPlace: stm_rx | stm_tx | pwm2 | ina2 | pwm4 | ina4 | gate | kick | ina1 | pwm1 | ina3 | pwm3 | JLCJLCJLCJLC